# EAGLE design puddingRemote (EAGLE 7.1.0)
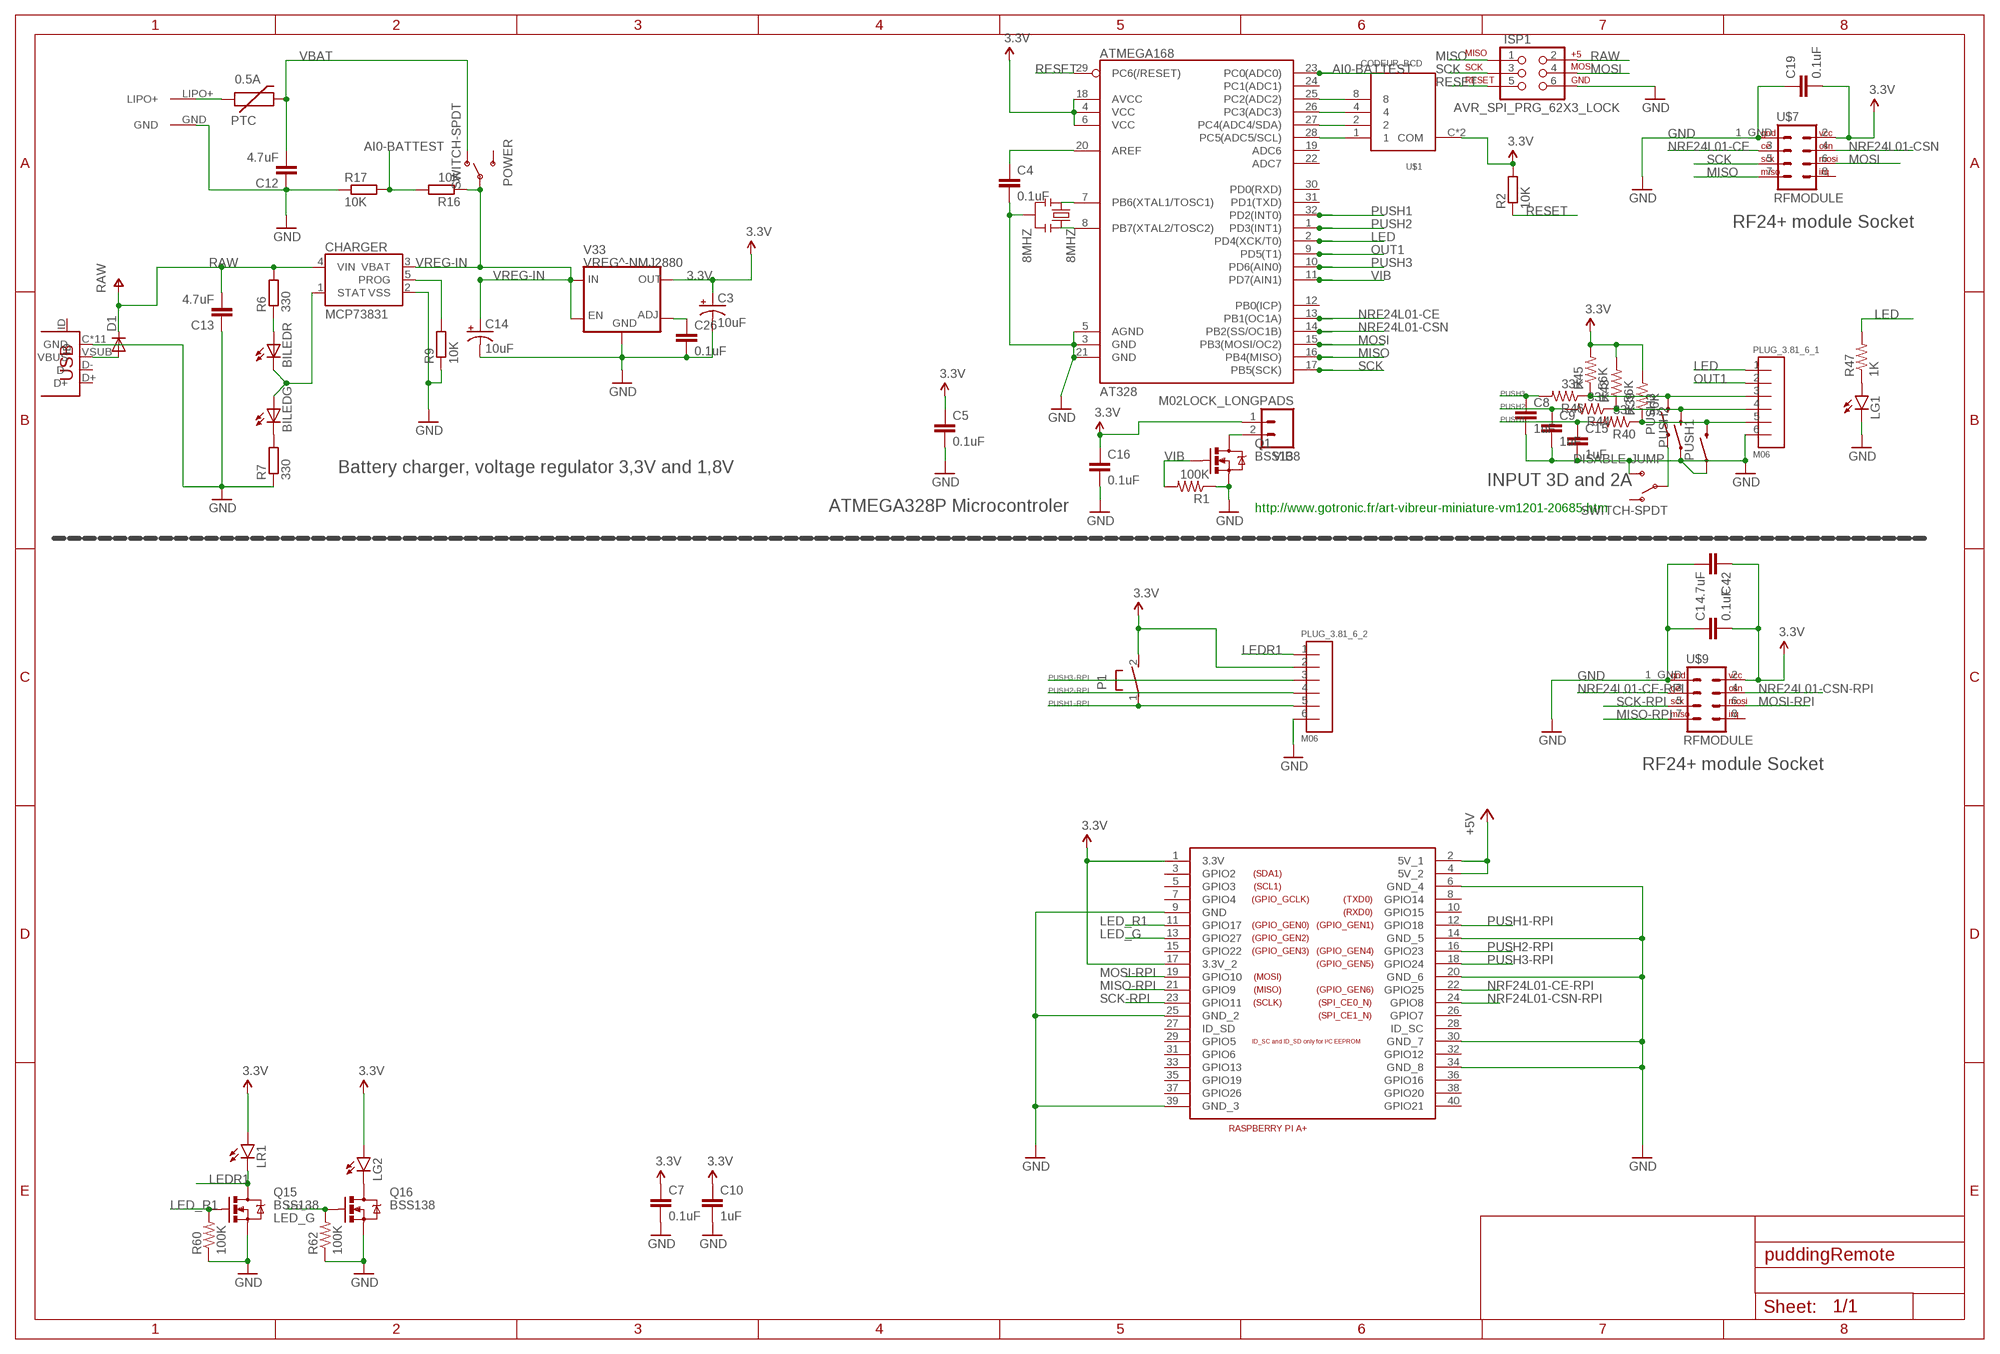
[diagram p0: schematic, sheet 1]

## Parts
0.5A  PTC  [PTC-1210]
8MHZ  8MHZ  RESONATOR8MHZ  [RESONATOR-SMD]
AT328  ATMEGA168  [TQFP32-08]
BILED  BILED  [2XLED]
C1  0.1uF  C-EUC0603  [C0603]
C3  10uF  CAP_POL1206  [EIA3216]
C4  0.1uF  C-EUC0603  [C0603]
C5  0.1uF  C-EUC0603  [C0603]
C7  0.1uF  C-EUC0603  [C0603]
C8  1uF  C-EUC0603  [C0603]
C9  1uF  C-EUC0603  [C0603]
C10  1uF  C-EUC0603  [C0603]
C12  4.7uF  C-EUC0603  [C0603]
C13  4.7uF  C-EUC0603  [C0603]
C14  10uF  CAP_POL1206  [EIA3216]
C15  1uF  C-EUC0603  [C0603]
C16  0.1uF  C-EUC0603  [C0603]
C19  0.1uF  C-EUC0603  [C0603]
C26  0.1uF  C-EUC0603  [C0603]
C42  4.7uF  C-EUC0603  [C0603]
CHARGER  MCP73831  [SOT23-5]
D1  DIODESMA-KIT  [SMA-DIODE-KIT]
DISABLE-JUMP  SWITCH-SPDT  [SWITCH-102011SAQN]
ISP1  AVR_SPI_PRG_62X3_LOCK  [2X3_LOCK]
LG1  LED1206  [LED-1206]
LG2  LED1206  [LED-1206]
LR1  LED1206  [LED-1206]
P1  31-XX  [B3F-31XX]
PLUG_3.81_6_1  M06  [PLUG_06]
PLUG_3.81_6_2  M06  [PLUG_06]
POWER  SWITCH-SPDT  [SWITCH-102011SAQN]
PUSH1  SWITCH-MOMENTARY-2PTH  [TACTILE-PTH]
PUSH2  SWITCH-MOMENTARY-2PTH  [TACTILE-PTH]
PUSH3  SWITCH-MOMENTARY-2PTH  [TACTILE-PTH]
Q1  BSS138  MOSFET-NCHANNELBSS138  [SOT23-3]
Q15  BSS138  MOSFET-NCHANNELBSS138  [SOT23-3]
Q16  BSS138  MOSFET-NCHANNELBSS138  [SOT23-3]
R1  100K  RESISTOR0603-RES  [0603-RES]
R2  10K  R-EU_R0603  [R0603]
R6  330  R-EU_R0603  [R0603]
R7  330  R-EU_R0603  [R0603]
R9  10K  R-EU_R0603  [R0603]
R16  10K  R-EU_R0603  [R0603]
R17  10K  R-EU_R0603  [R0603]
R39  56K  RESISTOR0603-RES  [0603-RES]
R40  33K  RESISTOR0603-RES  [0603-RES]
R43  56K  RESISTOR0603-RES  [0603-RES]
R44  33K  RESISTOR0603-RES  [0603-RES]
R45  56K  RESISTOR0603-RES  [0603-RES]
R46  33K  RESISTOR0603-RES  [0603-RES]
R47  1K  RESISTOR0603-RES  [0603-RES]
R60  100K  RESISTOR0603-RES  [0603-RES]
R62  100K  RESISTOR0603-RES  [0603-RES]
U$1  CODEUR_BCD  [MCRM4HAF-10R-V-B]
U$2  USB-MICROB  [USB-MICROB-10103594-0001LF]
U$4  RASPIRASPIB  [RASPIB]
U$7  RFMODULE  [2X5_RFMODULE]
U$8  LIPO_PAD  [2X1_LIPO_PAD]
U$9  RFMODULE  [2X5_RFMODULE]
V33  VREG^-NMJ2880  [SOT-89]
VIB  M02LOCK_LONGPADS  [1X02_LOCK_LONGPADS]

## Nets
1: AT328.28(PC5(ADC5/SCL)) U$1.1
2: AT328.27(PC4(ADC4/SDA)) U$1.2
3.3V [3.3V]: AT328.4(VCC) AT328.6(VCC) AT328.18(AVCC) C1.2 C3.A(+) C5.1 C7.1 C10.1 C16.1 C19.2 C42.1 LG2.A LR1.A P1.2(S) PLUG_3.81_6_2.2 R2.2 R39.2 R43.2 R45.2 U$1.C2(COM) U$1.C(COM) U$4.1(3.3V) U$4.17(3.3V_2) U$7.2(VCC) U$9.2(VCC) V33.4(OUT) VIB.1
4: AT328.26(PC3(ADC3)) U$1.4
8: AT328.25(PC2(ADC2)) U$1.8
+5V [5V]: U$4.2(5V_1) U$4.4(5V_2)
AI0-BATTEST: AT328.23(PC0(ADC0)) R16.2 R17.2
AREF: AT328.20(AREF) C4.1
GND [GND]: 8MHZ.2 AT328.3(GND) AT328.5(AGND) AT328.21(GND) C1.1 C3.C(-) C4.2 C5.2 C7.2 C8.2 C9.2 C10.2 C12.1 C13.1 C14.C(-) C15.2 C16.2 C19.1 C26.2 C42.2 CHARGER.2(VSS) DISABLE-JUMP.3(S) ISP1.6 LG1.C PLUG_3.81_6_1.6 PLUG_3.81_6_2.6 PUSH1.1 PUSH2.1 Q1.2(S) Q15.2(S) Q16.2(S) R1.1 R7.1 R9.1 R17.1 R60.1 R62.1 U$2.C1(GND) U$2.C3(GND) U$2.C4(GND) U$2.C5(GND) U$2.C6(GND) U$2.C(GND) U$2.GND U$2.P$1(GND) U$2.P$2(GND) U$2.P$3(GND) U$2.P$4(GND) U$4.6(GND_4) U$4.9(GND) U$4.14(GND_5) U$4.20(GND_6) U$4.25(GND_2) U$4.30(GND_7) U$4.34(GND_8) U$4.39(GND_3) U$7.1_GND(GND) U$8.GND U$9.1_GND(GND) V33.2(GND)
LED: AT328.2(PD4(XCK/T0)) PLUG_3.81_6_1.1 R47.2
LED_G: Q16.1(G) R62.2 U$4.13(GPIO27)
LED_R1: Q15.1(G) R60.2 U$4.11(GPIO17)
LEDR1: LR1.C PLUG_3.81_6_2.1 Q15.3(D)
LG1: LG2.C Q16.3(D)
MISO: AT328.16(PB4(MISO)) ISP1.1 U$7.7(MISO)
MISO-RPI: U$4.21(GPIO9) U$9.7(MISO)
MOSI: AT328.15(PB3(MOSI/OC2)) ISP1.4 U$7.6(MOSI)
MOSI-RPI: U$4.19(GPIO10) U$9.6(MOSI)
N$2: C26.1 V33.3(ADJ)
N$3: D1.A U$2.VSUB(VBUS)
N$5: Q1.3(D) VIB.2
N$7: 8MHZ.1 AT328.7(PB6(XTAL1/TOSC1))
N$8: 8MHZ.3 AT328.8(PB7(XTAL2/TOSC2))
N$15: LG1.A R47.1
N$17: DISABLE-JUMP.C(P) PUSH3.1
N$20: BILED.A2(R:A) R6.1
N$22: BILED.C3(G:C) R7.2
N$24: CHARGER.5(PROG) R9.2
NRF24L01-CE: AT328.13(PB1(OC1A)) U$7.3(CE)
NRF24L01-CE-RPI: U$4.22(GPIO25) U$9.3(CE)
NRF24L01-CSN: AT328.14(PB2(SS/OC1B)) U$7.4(CSN)
NRF24L01-CSN-RPI: U$4.24(GPIO8) U$9.4(CSN)
OUT1: AT328.9(PD5(T1)) PLUG_3.81_6_1.2
PUSH1: AT328.32(PD2(INT0)) C15.1 R40.2
PUSH1-RPI: P1.1(P) PLUG_3.81_6_2.5 U$4.12(GPIO18)
PUSH2: AT328.1(PD3(INT1)) C9.1 R44.2
PUSH2-RPI: PLUG_3.81_6_2.4 U$4.16(GPIO23)
PUSH3: AT328.10(PD6(AIN0)) C8.1 R46.2
PUSH3-RPI: PLUG_3.81_6_2.3 U$4.18(GPIO24)
RAW: C13.2 CHARGER.4(VIN) D1.C ISP1.2 R6.2
RESET: AT328.29(PC6(/RESET)) ISP1.5 R2.1
S1: PLUG_3.81_6_1.5 PUSH1.3 R39.1 R40.1
S2: PLUG_3.81_6_1.4 PUSH2.3 R43.1 R44.1
S3: PLUG_3.81_6_1.3 PUSH3.3 R45.1 R46.1
SCK: AT328.17(PB5(SCK)) ISP1.3 U$7.5(SCK)
SCK-RPI: U$4.23(GPIO11) U$9.5(SCK)
STAT: BILED.A1(G:A) BILED.C4(R:C) CHARGER.1(STAT)
VBAT: 0.5A.2 C12.2 POWER.1(O)
VBAT-RAW: 0.5A.1 U$8.LIPO+
VIB: AT328.11(PD7(AIN1)) Q1.1(G) R1.2
VREG-IN: C14.A(+) CHARGER.3(VBAT) POWER.C(P) R16.1 V33.1(EN) V33.5(IN)
Unconnected: AT328.12(PB0(ICP)) AT328.19(ADC6) AT328.22(ADC7) AT328.24(PC1(ADC1)) AT328.30(PD0(RXD)) AT328.31(PD1(TXD)) DISABLE-JUMP.1(O) POWER.3(S) U$2.D+ U$2.D- U$2.ID U$4.3(GPIO2) U$4.5(GPIO3) U$4.7(GPIO4) U$4.8(GPIO14) U$4.10(GPIO15) U$4.15(GPIO22) U$4.26(GPIO7) U$4.27(ID_SD) U$4.28(ID_SC) U$4.29(GPIO5) U$4.31(GPIO6) U$4.32(GPIO12) U$4.33(GPIO13) U$4.35(GPIO19) U$4.36(GPIO16) U$4.37(GPIO26) U$4.38(GPIO20) U$4.40(GPIO21) U$7.8(IRQ) U$9.8(IRQ)

## Notes on the sheet
- RF24+ module Socket
- Battery charger, voltage regulator 3,3V and 1,8V
- INPUT 3D and 2A
- ATMEGA328P Microcontroler | http://www.gotronic.fr/art-vibreur-miniature-vm1201-20685.htm
- RF24+ module Socket

## Library data of the parts
0.5A = pierre_vv:PTC; OC_FARNELL: 1822208; OC_RS: 7874202
8MHZ = SparkFun-FreqCtrl:RESONATOR: Resonator Small SMD resonator. Used, eg, on the Arduino Pro/ Pro Mini boards. 8MHz- XTAL-08895 16MHz- XTAL-08900; OC_FARNELL: 2443267; PROD_ID: XTAL-08895
AT328 = SparkFun:ATMEGA168; OC_FARNELL: 1715486
BILED = pierre_vv:BILED; OC_FARNELL: 5790888; OC_RS: 6921278
C1 C4 C5 C7-C10 C12 C13 C15 C16 C19 C26 C42 = rcl:C-EU: CAPACITOR, European symbol
C3 C14 = SparkFun:CAP_POL: Capacitor Polarized These are standard SMD and PTH capacitors. Normally 10uF, 47uF, and 100uF in electrolytic and tantalum varieties. Always verify the external diameter of the through hole cap, it varies with capacity, voltage, and manufacturer. The EIA devices should be standard.
CHARGER = SparkFun:MCP73831: Microchip's MCP73831 Miniature single cell, fully integrated Li-Ion, Li-polymer charge management controller http://ww1.microchip.com/downloads/en/DeviceDoc/21984a.pdf; OC_FARNELL: 1332158
D1 = SparkFun:DIODE: Diode These are standard reverse protection diodes and small signal diodes. SMA package can handle up to about 1A. SOD-323 can handle about 200mA. What the SOD-323 package when ordering, there are some mfgs out there that are 5-pin packages.; OC_FARNELL: 1861423
DISABLE-JUMP POWER = pierre_vv:SWITCH-SPDT; OC_FARNELL: 2320017
ISP1 = SparkFun:AVR_SPI_PRG_6: AVR ISP 6 Pin This is the reduced ISP connector for AVR programming. Common on Arduino. This footprint will take up less PCB space and can be used with a 10-pin to 6-pin adapter such as SKU: BOB-08508
LG1 LG2 = SparkFun-LED:LED: LEDs Standard schematic elements and footprints for 5mm, 3mm, 1206, and 0603 sized LEDs. 5mm - Spark Fun Electronics SKU : COM-00529 (and others); OC_FARNELL: 2426223
LR1 = SparkFun-LED:LED: LEDs Standard schematic elements and footprints for 5mm, 3mm, 1206, and 0603 sized LEDs. 5mm - Spark Fun Electronics SKU : COM-00529 (and others); OC_FARNELL: 2426229
P1 = switch-omron:31-XX: OMRON SWITCH; MPN: B3F-3100; OC_FARNELL: 2079502; OC_NEWARK: 36M3582
PLUG_3.81_6_1 PLUG_3.81_6_2 = pierre_vv:M06
PUSH1-PUSH3 = SparkFun-Electromechanical:SWITCH-MOMENTARY-2: Various NO switches- pushbuttons, reed, etc
Q1 Q15 Q16 = SparkFun-DiscreteSemi:MOSFET-NCHANNEL: Common NMOSFET Parts MFG P/N Store ID Prod ID FDD8780 TRANS-09984 SI7820DN TRANS-11055 FDS6630A IC-08089 2N7002PW TRANS-11151 FQP30N06L COM-10213 TRANS-10060 BSS123LT1G TRANS-08345 BSS138 TRANS-00830 BS170 2N7000; OC_FARNELL: 2053833; PROD_ID: TRANS-00830
R1 R39 R40 R43-R47 R60 R62 = SparkFun-Passives:RESISTOR: Resistor Basic schematic elements and footprints for 0603, 1206, and PTH resistors.
R2 R6 R7 R9 R16 R17 = rcl:R-EU_: RESISTOR, European symbol
U$1 = pierre_vv:CODEUR_BCD; OC_FARNELL: 2083002
U$2 = pierre_vv:USB-MICROB; OC_FARNELL: 2293752; OC_RS: 714-2347
U$4 = pierre_vv:RASPI; MOUNT: NO
U$7 U$9 = pierre_vv:RFMODULE
U$8 = pierre_vv:LIPO_PAD
V33 = pierre_vv:VREG^-NMJ2880; OC_RS: 7139341
VIB = SparkFun-Connectors:M02: Standard 2-pin 0.1" header. Use with - straight break away headers ( PRT-00116) - right angle break away headers (PRT-00553) - swiss pins (PRT-00743) - machine pins (PRT-00117) - female headers (PRT-00115) Molex polarized connector foot print use with: PRT-08233 with associated crimp pins and housings. 2.54_SCREWTERM for use with PRT-10571. 3.5mm Screw Terminal footprints for PRT-08084 5mm Screw Terminal footprints for use with PRT-08432

## Net classes
0 default: width 0.254 mm
1 GND: width 0.406 mm
2 3.3V: width 0.406 mm
3 5V: width 0.305 mm
4 230AC: width 0.61 mm, clearance 0.305 mm

## Board
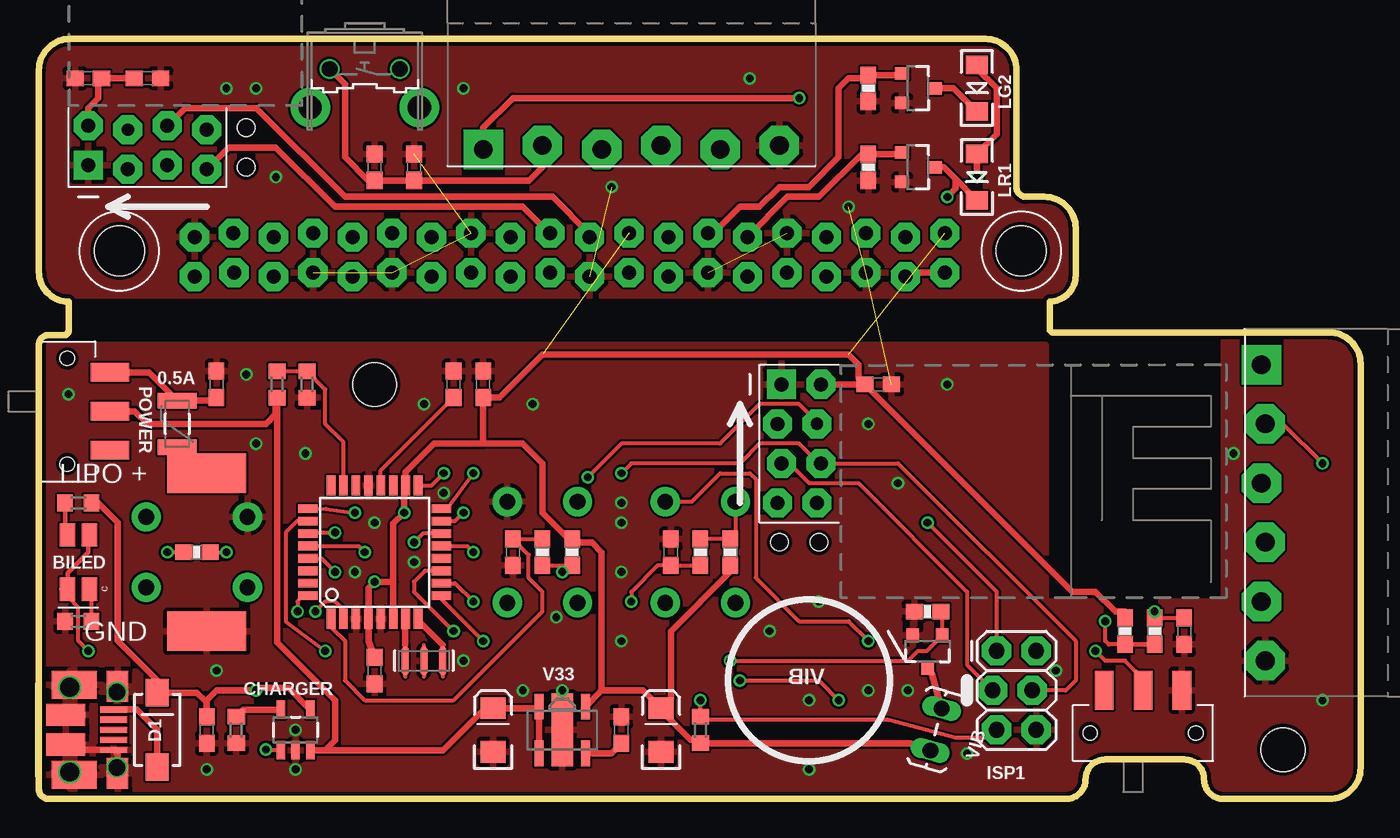
[diagram p1: board, top side]
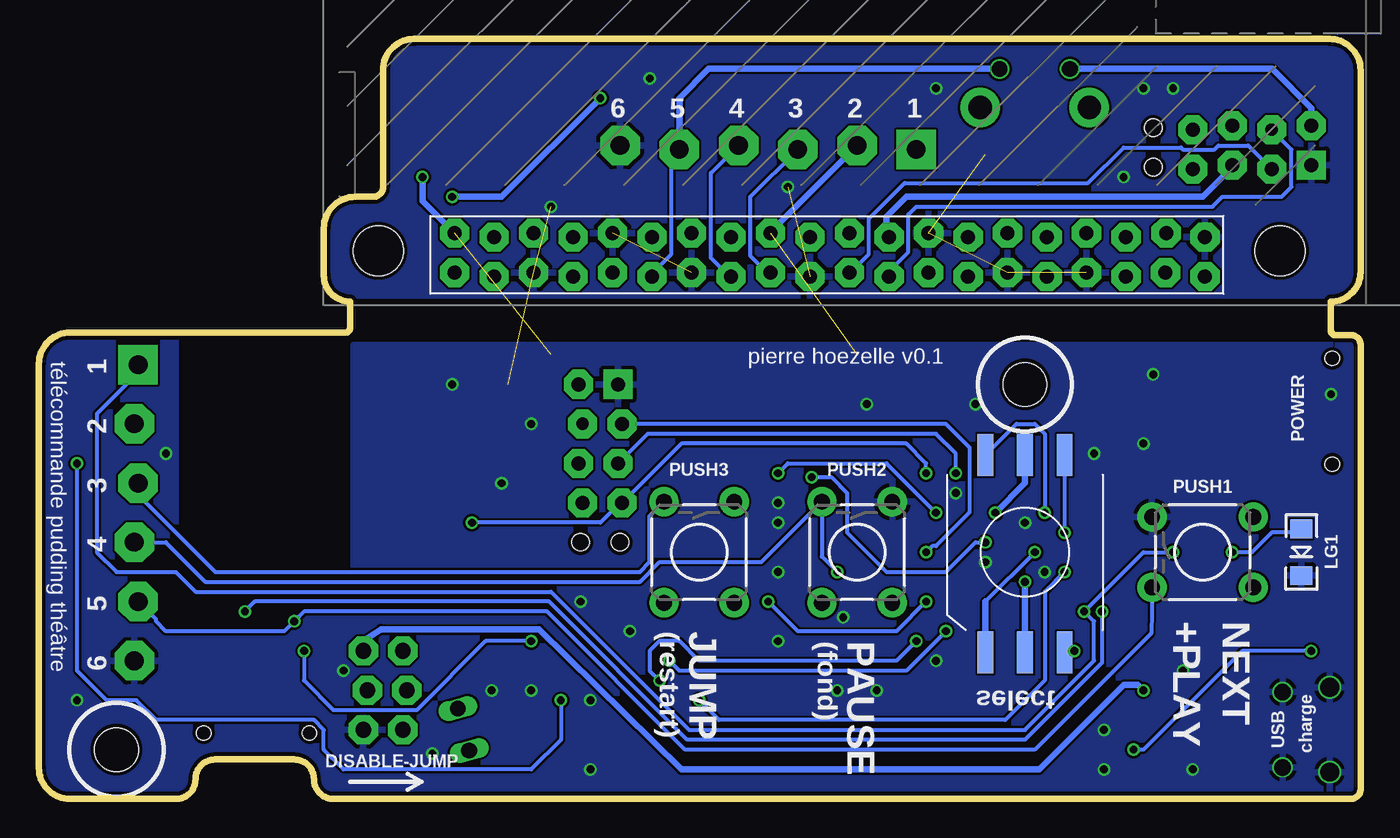
[diagram p2: board, bottom side, seen from below]

Size 85 x 48.9 mm. Coordinates in mm from the lower left corner, seen from the top.
Outline: 85,2 85,28 arc90 83,30 65.25,30 arc-90 65,30.25 65,32 arc90 66.67,33.67 66.67,36.73 arc90 64.67,38.73 63.5,38.73 arc-90 62.87,39.37 62.87,46.9 arc90 60.87,48.9 2,48.9 arc90 0,46.9 0,33.91 arc90 1.91,32 1.91,30.1 arc-90 1.65,29.84 0.64,29.84 arc90 0,29.21 0,0.64 arc90 0.64,0 66.04,0 arc90 67.31,1.27 arc-90 68.58,2.54 73.66,2.54 arc-90 74.93,1.27 arc90 76.2,0 83,0 arc90 85,2
Copper layers (1*16): Top 0.035mm / dielectric 1.5mm / Bottom 0.035mm
Design rules "SeeedStudio_2layer_DRU_no_angle_20140221 *": minimum track width 6mil, minimum drill 12mil, track to track 6mil, track to pad 6mil, pad to pad 6mil, via to via 6mil, smd to smd 0mil, copper to edge 10mil, drill to drill 10mil, minimum pad ring 5mil, minimum via ring 6mil, stop-mask expansion 2mil, vias tented up to drill 100mil, thermal gap 10mil
Holes 2.8 mm at 80.01,3.17 21.59,26.67

### Footprints (pad centres in the part's own frame; a part is rotated, then mirrored left to right if it is on the bottom)
PTC-1210 = smd 1 x 2.5: 1 -1.5,0; 2 1.5,0
RESONATOR-SMD = smd 0.45 x 1.905: 1 -1.2,0; 2 0,0; 3 1.2,0
TQFP32-08 = smd 1.27 x 0.559: 1 -4.293,2.8; 2 -4.293,2; 3 -4.293,1.2; 4 -4.293,0.4; 5 -4.293,-0.4; 6 -4.293,-1.2; 7 -4.293,-2; 8 -4.293,-2.8; 17 4.293,-2.8; 18 4.293,-2; 19 4.293,-1.2; 20 4.293,-0.4; 21 4.293,0.4; 22 4.293,1.2; 23 4.293,2; 24 4.293,2.8 | smd 0.559 x 1.27: 9 -2.8,-4.293; 10 -2,-4.293; 11 -1.2,-4.293; 12 -0.4,-4.293; 13 0.4,-4.293; 14 1.2,-4.293; 15 2,-4.293; 16 2.8,-4.293; 25 2.8,4.293; 26 2,4.293; 27 1.2,4.293; 28 0.4,4.293; 29 -0.4,4.293; 30 -1.2,4.293; 31 -2,4.293; 32 -2.8,4.293
2XLED = smd 1.5 x 1: A1 1.75,-0.7; A2 1.75,0.7; C3 -1.75,-0.7; C4 -1.75,0.7
C0603 = smd 1.1 x 1: 1 -0.85,0; 2 0.85,0
EIA3216 = smd 1.4 x 1.6: A 1.4,0; C -1.4,0
SOT23-5 = smd 0.55 x 1.2: 1 -0.95,-1.3; 2 0,-1.3; 3 0.95,-1.3; 4 0.95,1.3; 5 -0.95,1.3
SMA-DIODE-KIT = smd 1.77 x 1.47: A -2.4,0; C 2.4,0
SWITCH-102011SAQN = smd 1.2 x 2.5: 1 -2.5,0; 3 2.5,0; C 0,0 | hole 0.9: 3.4,-2.75; -3.4,-2.75
2X3_LOCK = drill 1.016 pad 1.88 octagon: 1 0,0; 2 0,2.54; 3 2.54,-0.254; 4 2.54,2.286; 5 5.08,0; 6 5.08,2.54
LED-1206 = smd 1.2 x 1.4: A -1.5,0; C 1.5,0
B3F-31XX = drill 1.016: 1 -2.261,-1.245; 2 2.261,-1.245 | drill 1.499 pad 2.54: 3 -3.505,1.245; 4 3.505,1.245
PLUG_06 = drill 1.2 pad 2.54 square: 1 -9.525,-0.127 | drill 1.2 pad 2.54 octagon: 2 -5.715,0.127; 3 -1.905,-0.127; 4 1.905,0.127; 5 5.715,-0.127; 6 9.525,0.127
TACTILE-PTH = drill 1.016 pad 1.88: 1 -3.251,2.261; 2 3.251,2.261; 3 -3.251,-2.261; 4 3.251,-2.261
SOT23-3 = smd 0.8 x 0.9: 1 -0.95,-1; 2 0.95,-1; 3 0,1.1
0603-RES = smd 1.1 x 1: 1 -0.85,0; 2 0.85,0
R0603 = smd 1 x 1.1: 1 -0.85,0; 2 0.85,0
MCRM4HAF-10R-V-B = smd 1 x 2.7: 1 -2.54,-6.45; 2 2.54,6.25; 4 2.54,-6.45; 8 -2.54,6.25; C 0,-6.45; C2 0,6.25
USB-MICROB-10103594-0001LF = smd 1.425 x 2.5: C -0.96,-3.075; C1 0.96,-3.075 | smd 1.8 x 2.9: C3 -2.9,-2.54; C4 2.9,-2.54 | smd 2 x 1.4: C5 -2.8,0.25; C6 2.8,0.25 | smd 0.4 x 1.75: D+ 0,0; D- -0.65,0; GND 1.3,0; ID 0.65,0; VSUB -1.3,0 | drill 1.2 pad 1.3: P$1 -2.725,-2.825; P$2 2.725,-2.825 | drill 1.05 pad 1.1: P$3 2.425,0.205; P$4 -2.425,0.205
RASPIB = drill 0.9 pad 1.88 octagon: 1 4.647,8.41; 2 2.107,8.41; 3 4.393,10.95; 4 1.853,10.95; 5 4.647,13.49; 6 2.107,13.49; 7 4.393,16.03; 8 1.853,16.03; 9 4.647,18.57; 10 2.107,18.57; 11 4.393,21.11; 12 1.853,21.11; 13 4.647,23.65; 14 2.107,23.65; 15 4.393,26.19; 16 1.853,26.19; 17 4.647,28.73; 18 2.107,28.73; 19 4.393,31.27; 20 1.853,31.27; 21 4.647,33.81; 22 2.107,33.81; 23 4.393,36.35; 24 1.853,36.35; 25 4.647,38.89; 26 2.107,38.89; 27 4.393,41.43; 28 1.853,41.43; 29 4.647,43.97; 30 2.107,43.97; 31 4.393,46.51; 32 1.853,46.51; 33 4.647,49.05; 34 2.107,49.05; 35 4.393,51.59; 36 1.853,51.59; 37 4.647,54.17; 38 2.107,54.13; 39 4.393,56.67; 40 1.853,56.67 | hole 3.2: 3.5,61.5; 3.5,3.5
2X5_RFMODULE = drill 0.9 pad 1.88 square: 1_GND 1.397,-1.27 | drill 0.9 pad 1.88 octagon: 2 3.937,-1.27; 3 1.143,-3.81; 5 1.397,-6.35; 6 3.937,-6.35; 7 1.143,-8.89; 8 3.683,-8.89 | drill 0.8 pad 1.88 octagon: 4 3.683,-3.81 | hole 1.1: 1.27,-11.43; 3.81,-11.43
2X1_LIPO_PAD = smd 5.08 x 2.54 bottom: GND -3.81,1.27; LIPO+ -3.81,-8.89
SOT-89 = smd 0.57 x 1.65: 1 -1.5,-1.5; 3 1.5,-1.5; 4 1.5,1.5; 5 -1.5,1.5 | smd 1.397 x 4.699: 2 0,0
1X02_LOCK_LONGPADS = drill 1.016 long: 1 -0.127,0; 2 2.667,0

### Placement (x,y rotation side)
0.5A  8.89,24.13 90 top
8MHZ  24.77,8.89 0 top
AT328  21.59,15.88 90 top
BILED  2.54,15.24 90 top
C1  3.17,46.35 0 top
C3  40.01,4.45 90 top
C4  26.67,26.67 90 top
C5  21.59,8.26 270 top
C7  24.13,40.64 90 top
C8  40.64,15.88 90 top
C9  30.48,15.88 270 top
C10  21.59,40.64 90 top
C12  11.43,26.67 270 top
C13  10.79,4.45 90 top
C14  29.21,4.45 90 top
C15  73.66,10.79 270 top
C16  28.57,26.67 90 top
C19  53.98,26.67 180 top
C26  37.47,4.45 90 top
C42  6.99,46.35 0 top
CHARGER  16.51,4.45 0 top
D1  7.62,4.45 90 top
DISABLE-JUMP  71,7 0 top
ISP1  61.59,9.53 270 top
LG1  3.81,15.88 270 bottom
LG2  60.33,45.72 270 top
LR1  60.33,40.01 270 top
P1  20.95,45.72 180 top
PLUG_3.81_6_1  78.74,18.41 270 top
PLUG_3.81_6_2  38.1,41.91 0 top
POWER  4.57,24.94 270 top
PUSH1  10.16,15.88 0 bottom
PUSH2  32.38,15.88 270 bottom
PUSH3  42.55,15.88 270 bottom
Q1  57.15,9.53 180 top
Q15  56.52,40.64 270 top
Q16  56.52,45.72 270 top
R1  57.15,12.06 0 top
R2  42.55,4.45 270 top
R6  2.54,19.05 0 top
R7  2.54,11.43 0 top
R9  12.7,4.45 90 top
R16  15.34,26.67 90 top
R17  17.24,26.67 90 top
R39  69.85,10.79 90 top
R40  71.75,10.79 90 top
R43  34.29,15.88 90 top
R44  32.38,15.88 90 top
R45  44.45,15.88 270 top
R46  42.55,15.88 270 top
R47  10.16,15.88 0 top
R60  53.34,40.64 90 top
R62  53.34,45.72 90 top
U$1  21.59,15.88 0 bottom
U$2  4.81,4.46 270 top
U$4  66.67,31.75 90 top
U$7  46.35,27.94 0 top
U$8  14.61,12.06 180 bottom
U$9  1.91,39.37 90 top
V33  33.66,4.45 0 top
VIB  57.36,3.24 75 top

### Tracks (layer width: path | path; a pad name or v marks a point on that pad's centre or on a via)
1  (via drill 0.5)
  Top 0.254: AT328.28 20.55,16.27 v20.95,15.88
  Bottom 0.254: 24.13,12.7 v20.95,15.88
  Bottom 0.406: U$1.1 24.13,12.7
2  (via drill 0.5)
  Top 0.254: AT328.27 17.37,17.14 v19.05,17.14
  Bottom 0.254: U$1.2 v19.05,17.14
3.3V  (via drill 0.5)  (2 unrouted)
  Top 0.406: U$9.2 3.17,44.45 3.81,45.09 3.81,46.14 C1.2 C42.1 | P1.2 19.68,45.97 19.68,41.27 21.17,39.79 C10.1 C7.1 31.54,39.79 32.38,40.64 PLUG_3.81_6_2.2 | v60.33,40.01 LR1.A 61.59,42.77 61.59,45.72 60.33,46.99 LG2.A | AT328.6 22.79,13.97 | 22.79,13.97 22.79,17.71 v23.5,18.41 23.5,20.07 AT328.18 23.59,21.05 25.4,22.86 28.57,22.86 | 28.57,22.86 C16.1 29.63,25.82 32.38,28.57 52.07,28.57 52.7,27.94 52.7,27.09 C19.2 | 22.79,13.97 v21.59,13.97 21.19,13.57 AT328.4 21.19,10.14 C5.1 | V33.4 36.2,6.99 | 36.2,6.99 38.87,6.99 C3.A | C3.A 40.01,5.71 41.91,3.81 42.33,3.81 R2.2 56.03,3.6 VIB.1 | U$7.2 C19.2 | 36.2,6.99 36.2,15.88 35.56,16.51 34.51,16.51 R43.2 34.29,16.51 32.38,18.41 32.38,21.59 31.11,22.86 28.57,22.86 | R45.2 44.45,14.61 40.64,10.79 40.64,6.48 C3.A | R39.2 69.85,12.06 69.22,12.06 67.94,13.34 66.46,13.34 C19.2
  Bottom 0.406: P1.2 5.69,46.97 3.17,44.45 U$9.2 | U$4.17 37.95,36.48 PLUG_3.81_6_2.2 | U$4.1 60.33,38.46 v60.33,40.01 | U$1.C v21.59,13.97 | v23.5,18.41 21.59,20.32 U$1.C2
4  (via drill 0.5)
  Top 0.254: AT328.26 16.61,17.88 15.88,17.14 15.88,11.43 v18.41,9.53
  Bottom 0.254: v18.41,9.53 U$1.4 19.05,9.53
8  (via drill 0.5)
  Top 0.254: AT328.25 18.45,18.67 v20.32,18.41
  Bottom 0.254: U$1.8 22.12,24.13 20.95,24.13 20.32,23.5 v20.32,18.41
+5V
  Top 0.406: U$4.4 55.98,33.86 U$4.2
AI0-BATTEST
  Top 0.254: AT328.23 19.59,22.95 18.41,24.13 18.41,26.34 R17.2 R16.2
AREF
  Top 0.254: AT328.20 21.99,21.14 C4.1
GND  (via drill 0.5)  (7 unrouted)
  Top 0.406: U$2.C1 2.08,3.16 U$2.GND 5.08,2.89 5.08,1.91 5.01,1.97 U$2.P$3
  other vias: 13.97,45.72 15.24,40.01 27.3,45.72 45.72,46.35 52.07,38.1 36.83,39.37 12.06,45.72 53.34,6.99 65.41,8.26 82.55,6.35 76.83,22.23 55.24,20.32 46.99,10.79 50.16,12.7 37.47,19.05 37.47,17.78 37.47,14.61 37.47,10.16 33.27,11.68 27.3,8.89 11.43,8.26 10.79,1.91 20.32,14.61 21.59,17.78 17.14,22.23 1.91,26.04 13.34,27.3 13.97,22.86 58.42,26.67 49.53,6.35 33.66,6.99 31.11,6.99 49.53,1.91 55.88,6.99 59.69,2.92 26.04,19.68 24.77,25.4 31.75,25.4 16.51,4.45 16.51,1.91 24.13,15.24 53.34,24.13
  pour Top: -1.27,29.21 64.77,29.21 64.77,12.7 76.2,12.7 76.2,31.11 86.36,31.11 86.36,-1.27 -1.27,-1.27
  pour Bottom: -2.54,29.21 64.77,29.21 64.77,12.7 76.2,12.7 76.2,31.11 87.63,31.11 87.63,-5.71 -4.45,-5.71 -4.45,29.21
  pour Bottom: -1.27,32.38 67.94,32.38 67.94,89.53 24.13,89.53 24.13,71.75 0.73,71.75 arc90 -1.27,69.75
  pour Top: -3.17,71.75 24.13,71.75 24.13,91.44 69.85,91.44 69.85,32.38 -3.17,32.38
LED  (via drill 0.5)
  Top 0.254: AT328.2 19.59,12.16 19.05,12.7 18.41,12.7 v17.78,12.06 | R47.2 v12.06,15.88
  Bottom 0.254: v12.06,15.88 13.97,15.88 v17.78,12.06 17.14,11.43 17.14,8.89 21.59,4.45 43.18,4.45 52.07,13.34 74.93,13.34 76.2,14.61 80.01,14.61 81.28,15.88 81.28,24.77 78.61,27.43 PLUG_3.81_6_1.1
LED_G
  Top 0.406: U$4.13 43.38,36.4 45.09,38.1 46.35,38.1 47.62,39.37 49.53,39.37 51.44,41.27 51.44,45.72 52.07,46.35 53.12,46.35 R62.2 55.41,46.57 Q16.1
LED_R1
  Top 0.406: U$4.11 48.16,38.73 50.16,38.73 52.92,41.49 R60.2 55.41,41.49 Q15.1
LEDR1  (via drill 0.5)
  Top 0.406: Q15.3 58.19,40.64 58.94,39.89 | PLUG_3.81_6_2.1 28.57,43.18 30.48,45.09 v48.9,45.09 | 58.94,39.89 LR1.C | v58.42,38.73 58.94,39.26 58.94,39.89
  Bottom 0.406: v48.9,45.09 55.24,38.73 v58.42,38.73
LG1
  Top 0.406: Q16.3 58.83,45.72 LG2.C
MISO  (via drill 0.5)
  Top 0.254: AT328.16 26.3,18.68 v27.94,20.95 | ISP1.1 61.59,13.34 v57.15,17.78
  Bottom 0.254: v27.94,20.95 27.94,21.59 29.21,22.86 43.69,22.86 U$7.7 47.62,19.05 48.9,17.78 v57.15,17.78
MISO-RPI
  Top 0.406: U$9.7 12.19,41.91 15.24,41.91 19.05,38.1 31.11,38.1 32.82,36.4 U$4.21
MOSI  (via drill 0.5)
  Top 0.254: v37.47,20.95 38.1,21.59 45.09,21.59 46.35,22.86 48.9,22.86 50.16,21.59 U$7.6 55.24,21.59 66.67,10.16 66.67,7.62 66.04,6.99 ISP1.4 | AT328.15 26.77,17.88 v27.3,18.41
  Bottom 0.254: v37.47,20.95 36.83,21.59 30.48,21.59 v27.3,18.41
MOSI-RPI
  Top 0.406: U$9.6 9.4,44.45 13.97,44.45 19.68,38.73 33.02,38.73 35.41,36.35 U$4.19
N$2
  Top 0.406: V33.3 36.81,2.94 C26.1
N$3
  Top 0.406: U$2.VSUB 6.31,5.76 7.62,4.45 D1.A
N$5
  Top 0.406: VIB.2 57.42,8.06 Q1.3
N$7
  Top 0.406: 23.57,9.91 23.57,11.56 AT328.7
N$8
  Top 0.406: AT328.8 24.39,11.48 25.96,9.91
N$15  (via drill 0.5)
  Top 0.254: R47.1 v8.26,15.88
  Bottom 0.254: LG1.A 4.04,17.14 5.71,17.14 6.99,15.88 v8.26,15.88
N$17  (via drill 0.5)
  Top 0.254: PUSH3.1 41.99,19.13 43.81,20.95 45.72,20.95 46.1,20.57 46.1,14.22 48.9,11.43 52.07,11.43 v53.34,10.16 | 71.12,7.62 69.85,8.89 68.58,8.89 v67.94,9.53
  Top 0.406: DISABLE-JUMP.C 71,7.33 arc-45 71.12,7.62
  Bottom 0.254: v53.34,10.16 56.26,10.16 60.71,5.71 66.04,5.71 67.94,7.62 v67.94,9.53
N$20
  Top 0.305: BILED.A2 1.69,16.99 R6.1
N$22
  Top 0.254: R7.2 3.39,13.34 BILED.C3
N$24
  Top 0.406: CHARGER.5 13.15,5.75 R9.2
NRF24L01-CE  (via drill 0.5)
  Top 0.254: AT328.13 27.54,16.27 v27.94,15.88
  Bottom 0.254: U$7.3 26.67,24.13 25.15,22.61 25.15,18.43 27.3,16.27 27.54,16.27 v27.94,15.88
NRF24L01-CE-RPI
  Bottom 0.254: U$4.22 32.82,33.86 31.62,35.05 31.62,37.34 29.34,39.62 17.53,39.62 15.24,41.91 11.56,41.91 11.43,41.78 9.4,41.78 9.14,42.04 7.24,42.04 U$9.3
NRF24L01-CSN  (via drill 0.5)
  Top 0.254: U$7.4 49.53,24.13 49.53,24.77 48.9,25.4 46.35,25.4 43.81,22.86 37.47,22.86 v35.31,20.7 | AT328.14 24.7,17.07 v24.13,16.51
  Bottom 0.254: v35.31,20.7 34.04,20.7 33.02,19.68 33.02,17.14 30.48,14.61 26.67,14.61 24.77,16.51 v24.13,16.51
NRF24L01-CSN-RPI
  Bottom 0.254: U$4.24 30.32,33.94 29.08,35.18 29.08,37.59 28.57,38.1 9.53,38.1 8.89,38.73 5.08,38.73 4.45,39.37 4.45,41.78 U$9.4
OUT1  (via drill 0.5)
  Top 0.254: AT328.9 25.88,12.85 v28.57,10.16 | v45.09,7.62 50.16,7.62 v51.44,6.35 | PLUG_3.81_6_1.2 80.01,24.13 v82.55,21.59
  Bottom 0.254: v28.57,10.16 29.84,8.89 42.55,8.89 43.81,10.16 45.09,10.16 45.72,9.53 45.72,8.26 v45.09,7.62 | v51.44,6.35 51.44,3.81 53.34,1.91 65.41,1.91 66.67,3.17 66.67,4.45 67.31,5.08 77.47,5.08 78.74,6.35 80.64,6.35 82.55,8.26 v82.55,21.59
PUSH1  (via drill 0.5)
  Top 0.254: AT328.32 16.89,13.07 16.64,12.7 v16.64,12.06 | v71.75,12.06 R40.2 C15.1
  Bottom 0.254: v16.64,12.06 16.64,8.76 21.59,3.81 43.31,3.81 52.2,12.7 71.12,12.7 v71.75,12.06
PUSH1-RPI
  Bottom 0.254: U$4.12 45.56,33.81 44.32,35.05 44.32,41.27 PLUG_3.81_6_2.5
  Bottom 0.406: P1.1 41.94,46.97 43.81,45.09 PLUG_3.81_6_2.5
PUSH2
  Top 0.254: AT328.1 18.79,11.05 19.68,10.16 19.68,7.62 20.95,6.35 26.67,6.35 32.38,12.06 32.38,13.34 31.5,14.22 31.5,15.71 C9.1 R44.2
PUSH2-RPI
  Bottom 0.254: U$4.16 40.59,33.6 41.78,34.8 41.78,40.26 PLUG_3.81_6_2.4
PUSH3  (via drill 0.5)
  Top 0.254: AT328.10 26.77,13.88 v27.94,12.7 | v38.1,12.7 38.1,13.34 39.79,15.03 C8.1 R46.2
  Bottom 0.254: v27.94,12.7 29.84,10.79 36.2,10.79 v38.1,12.7
PUSH3-RPI
  Bottom 0.254: U$4.18 38.17,33.86 39.24,34.92 39.24,38.73 PLUG_3.81_6_2.3
RAW  (via drill 0.5)
  Top 0.406: CHARGER.4 16.05,7.16 14.14,7.16 v13.97,6.99 11.43,6.99 10.72,6.28 | C13.2 10.79,6.21 10.72,6.28 | 10.72,6.28 10.16,6.84 D1.C 7.62,7.62 5.08,10.16 5.08,17.78 3.81,19.05 R6.2
  Bottom 0.406: ISP1.2 64.14,10.16 62.99,10.92 52.83,10.92 43.69,1.91 20.66,1.91 15.24,7.33 14.31,7.33 v13.97,6.99
RESET  (via drill 0.5)
  Top 0.254: AT328.29 18.18,15.47 v19.05,14.61 | v42.55,6.35 R2.1 42.76,5.08 54.61,5.08 58.93,3.94 61.59,3.94 ISP1.5
  Bottom 0.254: v19.05,14.61 20.32,13.34 20.32,7.62 22.86,5.08 41.27,5.08 v42.55,6.35
S1  (via drill 0.5)
  Top 0.254: R39.1 R40.1 68.8,9.95 68.58,10.16 v68.58,11.43
  Bottom 0.254: PUSH1.3 13.41,11.99 13.46,10.67 20.95,3.17 43.43,3.17 52.32,12.06 67.94,12.06 v68.58,11.43 69.22,10.79 76.83,10.79 77.47,11.43 77.47,11.56 PLUG_3.81_6_1.5
S2  (via drill 0.5)
  Top 0.254: R44.1 33.66,15.03 | 33.66,15.03 R43.1 | 33.66,15.03 v33.66,14.61
  Bottom 0.254: PLUG_3.81_6_1.4 76.83,16.51 74.3,13.97 46.35,13.97 45.09,15.24 38.53,15.24 PUSH2.3 34.65,15.6 v33.66,14.61
S3
  Top 0.254: PUSH3.3 44.81,17.08 R45.1 R46.1
  Bottom 0.254: PLUG_3.81_6_1.3 78.61,19.56 73.66,14.61 46.35,14.61 45.72,15.24 45.72,18.21 PUSH3.3
SCK  (via drill 0.5)
  Top 0.254: AT328.17 25.25,20.17 v26.04,20.95 | U$7.5 48.26,21.59 49.53,20.32 52.7,20.32 59.69,13.34 59.69,8.64 ISP1.3
  Bottom 0.254: v26.04,20.95 26.04,22.23 27.3,23.5 45.85,23.5 U$7.5
SCK-RPI
  Bottom 0.406: U$4.23 30.48,36.3 30.48,37.47 29.21,38.73 10.16,38.73 8.26,40.64 U$9.5
STAT  (via drill 0.5)
  Top 0.254: 1.43,13.49 BILED.C4 1.91,13.43 1.91,12.95 2.54,12.32 2.54,10.16 v3.17,9.53 | CHARGER.1 14.63,3.15 v14.61,3.17
  Top 0.305: BILED.C4 1.84,14.54 3.17,15.88 3.17,16.93 BILED.A1
  Bottom 0.254: v3.17,9.53 7.62,9.53 13.97,3.17 v14.61,3.17
VBAT
  Top 0.406: POWER.1 7.08,27.44 0.5A.2 11.24,25.63 C12.2
VBAT-RAW
  Top 0.254: U$8.LIPO+ 10.56,20.95 0.5A.1
VIB  (via drill 0.5)
  Top 0.254: AT328.11 24.84,14.68 24.13,13.97 24.13,13.34 v26.67,10.79 | v44.45,8.89 55.88,8.89 56.52,9.53 57.1,9.53 Q1.1 58.1,11.96 R1.2
  Bottom 0.254: v26.67,10.79 29.21,8.26 43.81,8.26 v44.45,8.89
VREG-IN
  Top 0.406: C14.A 29.84,5.84 | 29.84,5.84 32.05,5.84 V33.5 V33.1 | CHARGER.3 18.41,3.15 | 18.41,3.15 26,3.15 28.57,5.71 29.71,5.71 29.84,5.84 | POWER.C 6.18,24.94 6.99,24.13 14.61,24.13 15.24,24.77 15.24,25.73 R16.1 15.34,10.06 19.05,6.35 19.05,3.78 18.41,3.15

### Text on the board
tPlace: VIB
bPlace: pierre hoezelle v0.1 | télécommande pudding théâtre | POWER | charge | USB
bNames: NEXT | +PLAY | JUMP | (restart) | PAUSE | (fond) | select
200bmp: /Volumes/myDoc/documents/régies/pudding/pud.bmp